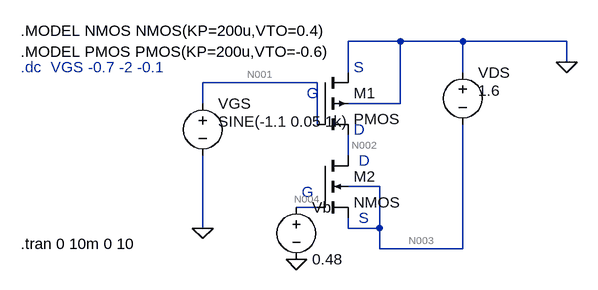
[diagram p0: schematic PMOS-NMOS.asc]
PMOS-NMOS.asc, the LTspice schematic file:
Version 4
SHEET 1 880 680
WIRE 256 -16 176 -16
WIRE 352 -16 256 -16
WIRE 512 -16 352 -16
WIRE 512 16 512 -16
WIRE 176 32 176 -16
WIRE 352 32 352 -16
WIRE 128 48 -48 48
WIRE -48 80 -48 48
WIRE 256 80 256 -16
WIRE 256 80 176 80
WIRE 128 112 128 48
WIRE 176 160 176 128
WIRE 224 208 176 208
WIRE 128 240 96 240
WIRE -48 272 -48 160
WIRE 176 272 176 256
WIRE 224 272 224 208
WIRE 224 272 176 272
WIRE 224 304 224 272
WIRE 352 304 352 112
WIRE 352 304 224 304
FLAG -48 272 0
FLAG 512 16 0
FLAG 96 320 0
DATAFLAG 176 144 ""
SYMBOL voltage 352 16 R0
WINDOW 123 0 0 Left 0
WINDOW 39 0 0 Left 0
WINDOW 3 24 44 Left 2
SYMATTR Value 1.6
SYMATTR InstName VDS
SYMBOL voltage -48 64 R0
WINDOW 123 0 0 Left 0
WINDOW 39 0 0 Left 0
WINDOW 3 24 44 Left 2
SYMATTR Value SINE(-1.1 0.05 1k)
SYMATTR InstName VGS
SYMBOL pmos4 128 32 R0
SYMATTR InstName M1
SYMATTR Value2 l=1u w=100u
SYMBOL nmos4 128 160 R0
SYMATTR InstName M2
SYMATTR Value2 l=1u w=100u
SYMBOL voltage 96 224 R0
WINDOW 123 0 0 Left 0
WINDOW 39 0 0 Left 0
SYMATTR InstName Vb
SYMATTR Value 0.48
TEXT 184 120 Left 2 ;D
TEXT 112 64 Left 2 ;G
TEXT 184 24 Left 2 ;S
TEXT -328 0 Left 2 !.MODEL PMOS PMOS(KP=200u,VTO=-0.6)
TEXT -328 24 Left 2 ;.dc  VGS -0.7 -2 -0.1
TEXT -328 296 Left 2 !.tran 0 10m 0 10
TEXT 192 256 Left 2 ;S
TEXT 192 168 Left 2 ;D
TEXT 104 216 Left 2 ;G
TEXT -328 -32 Left 2 !.MODEL NMOS NMOS(KP=200u,VTO=0.4)

The netlist it stands for:
* PMOS-NMOS.asc
VDS 0 N003 1.6
VGS N001 0 SINE(-1.1 0.05 1k)
M1 0 N001 N002 0 PMOS l=1u w=100u
M2 N002 N004 N003 N003 NMOS l=1u w=100u
Vb N004 0 0.48
.model NMOS NMOS
.model PMOS PMOS
.lib standard.mos
* D
* G
* S
.MODEL PMOS PMOS(KP=200u,VTO=-0.6)
* .dc  VGS -0.7 -2 -0.1
.tran 0 10m 0 10
* S
* D
* G
.MODEL NMOS NMOS(KP=200u,VTO=0.4)
.backanno
.end

* Results of the author's LTspice run, read from the files saved beside the schematic
* Operating Point, zero values left out:
*   V(n003) = -1.6 V
*   V(n001) = -1.1 V
*   V(n002) = -1.524 V
*   V(n004) = 480 mV
*   Id(M2) = 2.5 mA
*   Is(M2) = -2.5 mA
*   Id(M1) = 2.5 mA
*   Ib(M1) = 1.534 pA
*   Is(M1) = -2.5 mA
*   I(Vds) = -2.5 mA
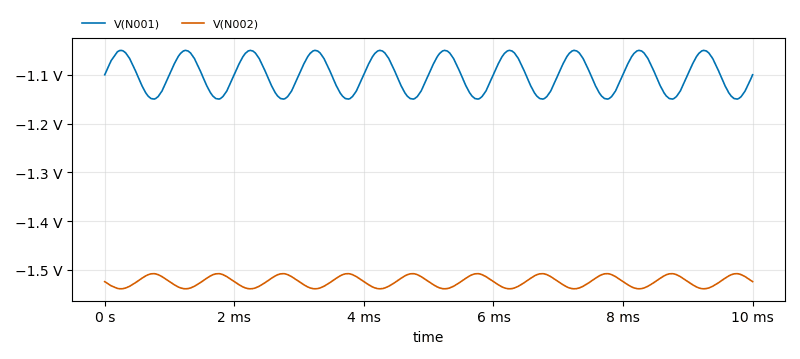
[diagram p1: Transient Analysis of PMOS-NMOS.asc, plotted from the saved traces]
* Transient Analysis, 1 run:
*   V(N001): min -1.15 V, max -1.05 V, average -1.1 V, rms 1.101 V, last -1.1 V
*   V(N002): min -1.539 V, max -1.508 V, average -1.523 V, rms 1.523 V, last -1.524 V